# EAGLE design rf_front_lf (EAGLE 9.6.2)
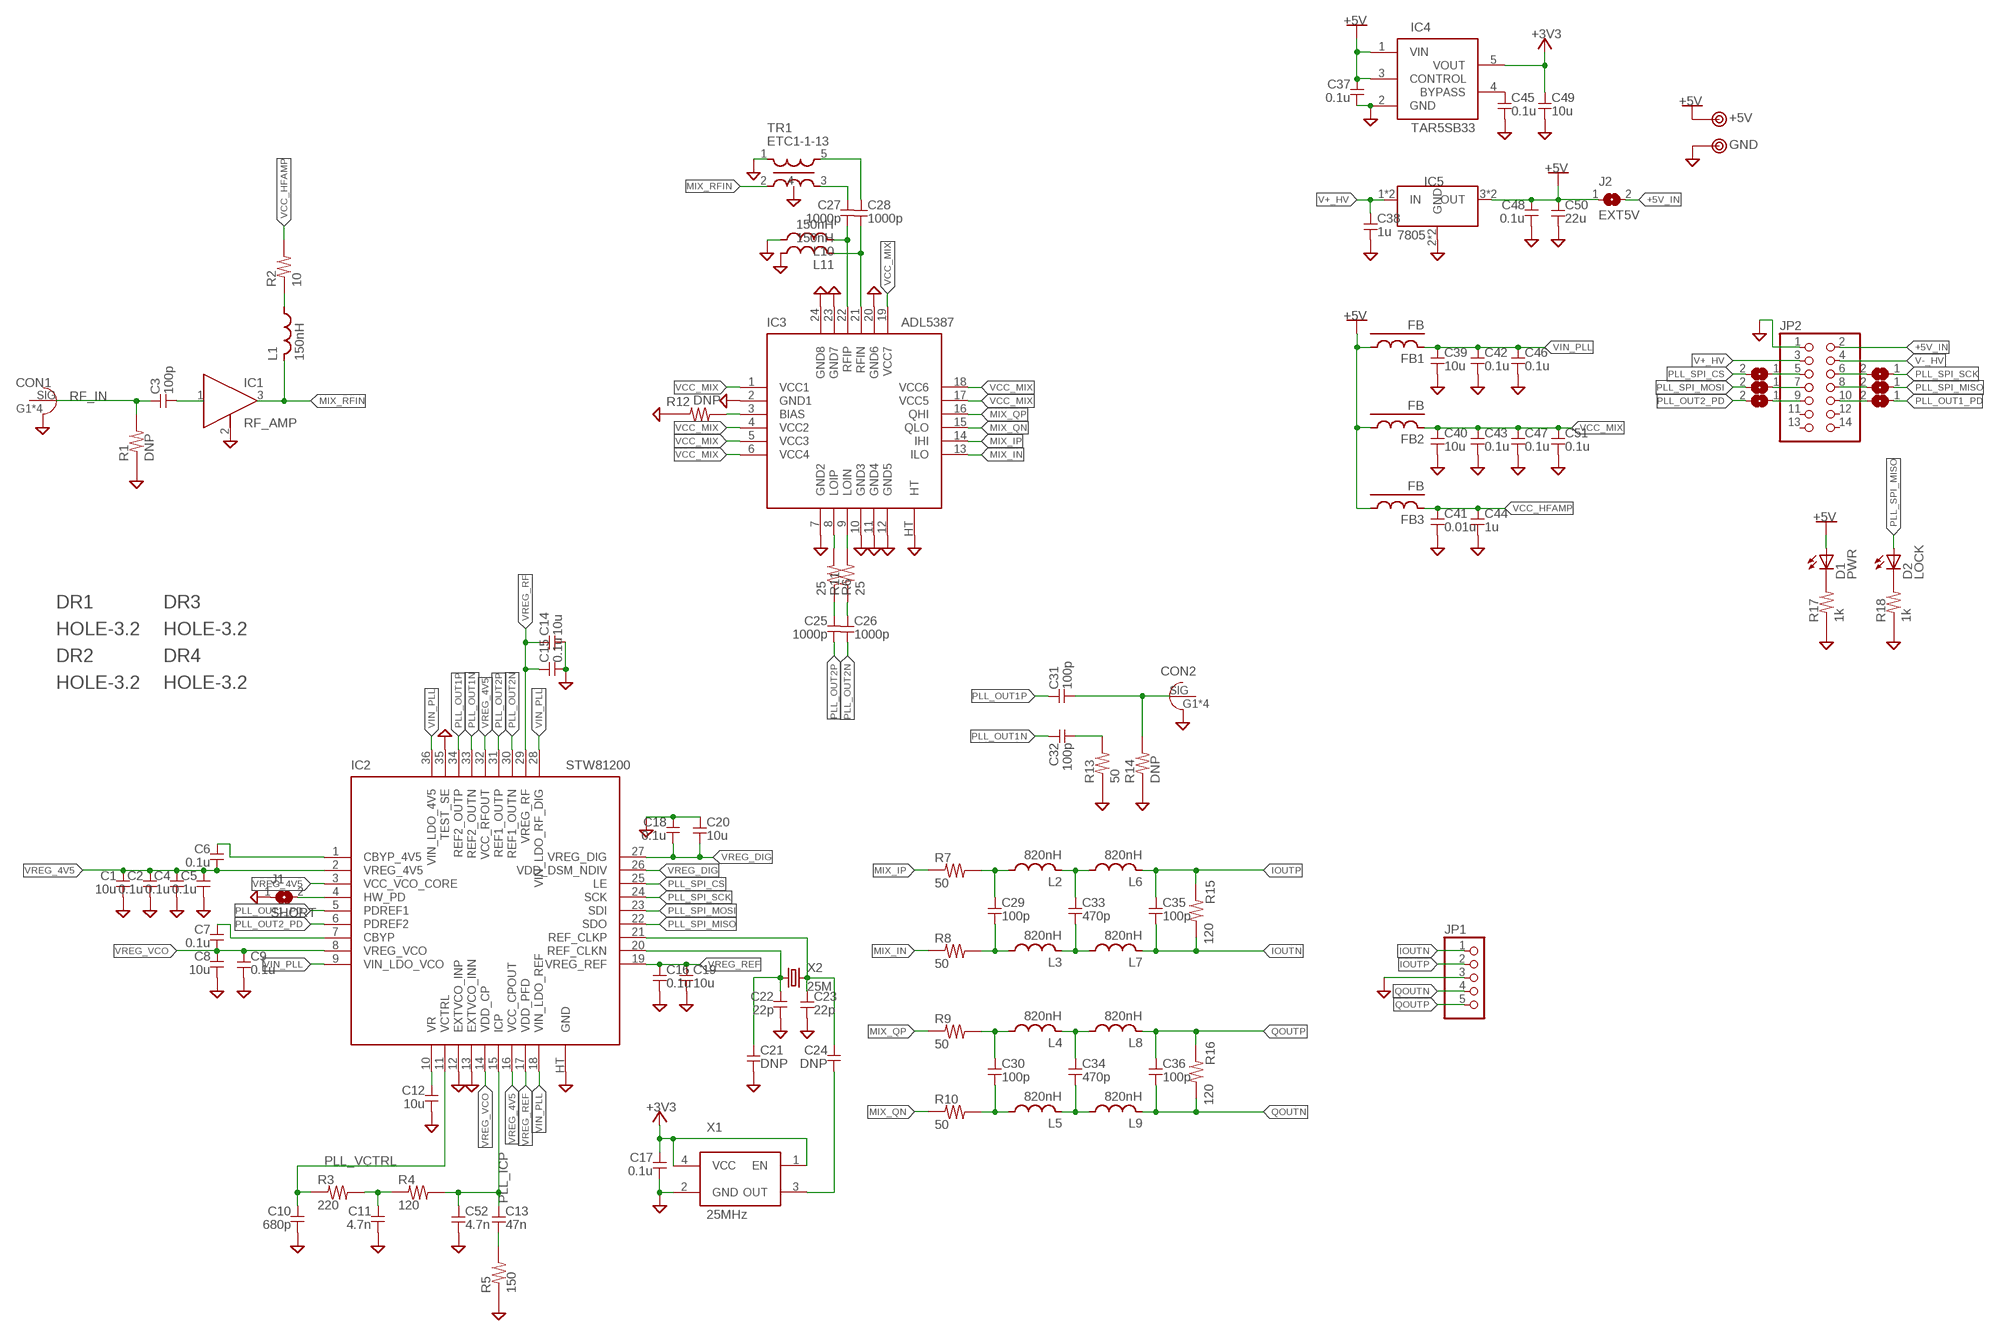
[diagram p0: schematic, sheet 1]

## Parts
C1  10u  C-1608  [1608]
C2  0.1u  C-1608  [1608]
C3  100p  C-1608  [1608]
C4  0.1u  C-1608  [1608]
C5  0.1u  C-1608  [1608]
C6  0.1u  C-1608  [1608]
C7  0.1u  C-1608  [1608]
C8  10u  C-1608  [1608]
C9  0.1u  C-1608  [1608]
C10  680p  C-1608  [1608]
C11  4.7n  C-1608  [1608]
C12  10u  C-1608  [1608]
C13  47n  C-1608  [1608]
C14  10u  C-1608  [1608]
C15  0.1u  C-1608  [1608]
C16  0.1u  C-1608  [1608]
C17  0.1u  C-1608  [1608]
C18  0.1u  C-1608  [1608]
C19  10u  C-1608  [1608]
C20  10u  C-1608  [1608]
C21  DNP  C-1608  [1608]
C22  22p  C-1608  [1608]
C23  22p  C-1608  [1608]
C24  DNP  C-1608  [1608]
C25  1000p  C-1608  [1608]
C26  1000p  C-1608  [1608]
C27  1000p  C-1608  [1608]
C28  1000p  C-1608  [1608]
C29  100p  C-1608  [1608]
C30  100p  C-1608  [1608]
C31  100p  C-1608  [1608]
C32  100p  C-1608  [1608]
C33  470p  C-1608  [1608]
C34  470p  C-1608  [1608]
C35  100p  C-1608  [1608]
C36  100p  C-1608  [1608]
C37  0.1u  C-1608  [1608]
C38  1u  C-1608  [1608]
C39  10u  C-2012  [2012]
C40  10u  C-2012  [2012]
C41  0.01u  C-1608  [1608]
C42  0.1u  C-1608  [1608]
C43  0.1u  C-1608  [1608]
C44  1u  C-1608  [1608]
C45  0.1u  C-1608  [1608]
C46  0.1u  C-1608  [1608]
C47  0.1u  C-1608  [1608]
C48  0.1u  C-1608  [1608]
C49  10u  C-1608  [1608]
C50  22u  C-3225  [3225]
C51  0.1u  C-1608  [1608]
C52  4.7n  C-1608  [1608]
CON1  RF_IN  SMA-142-0701-801  [SMA-EDGE]
CON2  PLL_OUT  SMA-142-0701-801  [SMA-EDGE]
D1  PWR  LED-SMD1608  [D1608]
D2  LOCK  LED-SMD1608  [D1608]
DR1  HOLE-3.2  [HOLE_3.2]
DR2  HOLE-3.2  [HOLE_3.2]
DR3  HOLE-3.2  [HOLE_3.2]
DR4  HOLE-3.2  [HOLE_3.2]
FB1  FB  [1608-J]
FB2  FB  [1608-J]
FB3  FB  [1608-J]
IC1  RF_AMP  [SOT89]
IC2  STW81200  [VFQFPN36]
IC3  ADL5387  [LFCSP24]
IC4  TAR5SB33  [SOT23-5]
IC5  7805  78X-3  [TO220-SOP-DUAL]
J1  SHORT  SJ-1608  [1608-J]
J2  EXT5V  SJ-1608  [1608-J]
J3  CS  SJ-1608  [1608-J]
J4  MOSI  SJ-1608  [1608-J]
J5  PD2  SJ-1608  [1608-J]
J6  SCK  SJ-1608  [1608-J]
J7  MISO  SJ-1608  [1608-J]
J8  PD1  SJ-1608  [1608-J]
JP1  PINHD-1X5  [1X05]
JP2  PINHD-2X7  [2X07]
L1  150nH  L-1608  [1608]
L2  820nH  L-1608  [1608]
L3  820nH  L-1608  [1608]
L4  820nH  L-1608  [1608]
L5  820nH  L-1608  [1608]
L6  820nH  L-1608  [1608]
L7  820nH  L-1608  [1608]
L8  820nH  L-1608  [1608]
L9  820nH  L-1608  [1608]
L10  150nH  L-1608  [1608]
L11  150nH  L-1608  [1608]
R1  DNP  R-1608  [1608]
R2  10  R-1608  [1608]
R3  220  R-1608  [1608]
R4  120  R-1608  [1608]
R5  150  R-1608  [1608]
R6  25  R-1608  [1608]
R7  50  R-1608  [1608]
R8  50  R-1608  [1608]
R9  50  R-1608  [1608]
R10  50  R-1608  [1608]
R11  25  R-1608  [1608]
R12  DNP  R-1608  [1608]
R13  50  R-1608  [1608]
R14  DNP  R-1608  [1608]
R15  120  R-1608  [1608]
R16  120  R-1608  [1608]
R17  1k  R-1608  [1608]
R18  1k  R-1608  [1608]
TP1  +5V  TESTPIN  [TESTPIN]
TP2  GND  TESTPIN  [TESTPIN]
TR1  ETC1-1-13  [ETC1-1-13]
X1  25MHz  OSC-KC3225  [KC3225]
X2  25M  CRYSTALHC49S  [HC49/S]

## Nets
+3V3: C17.1 C49.1 IC4.5(VOUT) X1.1(EN) X1.4(VCC)
+5V: C37.1 C48.1 C50.1 D1.A FB1.1 FB2.1 FB3.1 IC4.1(VIN) IC4.3(CONTROL) IC5.3(OUT) IC5.6(OUT) J2.1 TP1.1
+5V_IN: J2.2 JP2.2
GND: C1.2 C2.2 C4.2 C5.2 C8.2 C9.2 C10.2 C11.2 C12.2 C14.2 C15.2 C16.2 C17.2 C18.1 C19.2 C20.1 C21.2 C22.2 C23.2 C37.2 C38.2 C39.2 C40.2 C41.2 C42.2 C43.2 C44.2 C45.2 C46.2 C47.2 C48.2 C49.2 C50.2 C51.2 C52.2 CON1.G1(GND) CON1.G2(GND) CON1.G3(GND) CON1.G4(GND) CON2.G1(GND) CON2.G2(GND) CON2.G3(GND) CON2.G4(GND) IC1.2(GND) IC2.12(EXTVCO_INP) IC2.13(EXTVCO_INN) IC2.35(TEST_SE) IC2.HT(GND) IC3.2(GND1) IC3.7(GND2) IC3.10(GND3) IC3.11(GND4) IC3.12(GND5) IC3.20(GND6) IC3.23(GND7) IC3.24(GND8) IC3.HT IC4.2(GND) IC5.2(GND) IC5.5(GND) J1.1 JP1.3 JP2.1 L10.1 L11.1 R1.1 R5.1 R12.1 R13.1 R14.1 R17.1 R18.1 TP2.1 TR1.1 TR1.4 X1.2(GND)
IOUTN: C35.2 JP1.1 L7.2 R15.1
IOUTP: C35.1 JP1.2 L6.2 R15.2
MIX_IN: IC3.13(ILO) R8.1
MIX_IP: IC3.14(IHI) R7.1
MIX_QN: IC3.15(QLO) R10.1
MIX_QP: IC3.16(QHI) R9.1
MIX_RFIN: IC1.3(OUT) L1.2 TR1.2
N$1: C3.2 IC1.1(IN)
N$2: C13.2 R5.2
N$3: C33.1 L2.2 L6.1
N$4: C27.2 IC3.22(RFIP) L10.2
N$5: C11.1 R3.2 R4.1
N$6: C33.2 L3.2 L7.1
N$7: C30.1 L4.1 R9.2
N$8: C28.2 IC3.21(RFIN) L11.2
N$9: C30.2 L5.1 R10.2
N$10: C34.1 L4.2 L8.1
N$11: C34.2 L5.2 L9.1
N$12: C12.1 IC2.10(VR)
N$13: C6.1 IC2.1(CBYP_4V5)
N$14: C21.1 C22.1 IC2.20(REF_CLKN) X2.1
N$15: C7.1 IC2.7(CBYP)
N$16: C23.1 C24.1 IC2.21(REF_CLKP) X2.2
N$17: C27.1 TR1.3
N$18: C28.1 TR1.5
N$19: L1.1 R2.1
N$20: IC3.9(LOIN) R11.2
N$21: C24.2 X1.3(OUT)
N$22: C45.1 IC4.4(BYPASS)
N$23: C31.2 CON2.SIG R14.2
N$24: J3.1 JP2.5
N$25: J4.1 JP2.7
N$26: C32.2 R13.2
N$27: J5.1 JP2.9
N$28: J8.2 JP2.10
N$29: J7.2 JP2.8
N$30: J6.2 JP2.6
N$31: IC2.4(HW_PD) J1.2
N$32: C29.1 L2.1 R7.2
N$33: C29.2 L3.1 R8.2
N$34: D1.K R17.2
N$35: IC3.3(BIAS) R12.2
N$36: IC3.8(LOIP) R6.2
N$37: C25.1 R6.1
N$38: C26.1 R11.1
N$39: D2.K R18.2
PLL_ICP: C13.1 C52.1 IC2.15(ICP) R4.2
PLL_OUT1_PD: IC2.5(PDREF1) J8.1
PLL_OUT1N: C32.1 IC2.33(REF2_OUTN)
PLL_OUT1P: C31.1 IC2.34(REF2_OUTP)
PLL_OUT2_PD: IC2.6(PDREF2) J5.2
PLL_OUT2N: C26.2 IC2.30(REF1_OUTN)
PLL_OUT2P: C25.2 IC2.31(REF1_OUTP)
PLL_SPI_CS: IC2.25(LE) J3.2
PLL_SPI_MISO: D2.A IC2.22(SDO) J7.1
PLL_SPI_MOSI: IC2.23(SDI) J4.2
PLL_SPI_SCK: IC2.24(SCK) J6.1
PLL_VCTRL: C10.1 IC2.11(VCTRL) R3.1
QOUTN: C36.2 JP1.4 L9.2 R16.1
QOUTP: C36.1 JP1.5 L8.2 R16.2
RF_IN: C3.1 CON1.SIG R1.2
V+_HV: C38.1 IC5.1(IN) IC5.4(IN) JP2.3
V-_HV: JP2.4
VCC_HFAMP: C41.1 C44.1 FB3.2 R2.2
VCC_MIX: C40.1 C43.1 C47.1 C51.1 FB2.2 IC3.1(VCC1) IC3.4(VCC2) IC3.5(VCC3) IC3.6(VCC4) IC3.17(VCC5) IC3.18(VCC6) IC3.19(VCC7)
VIN_PLL: C39.1 C42.1 C46.1 FB1.2 IC2.9(VIN_LDO_VCO) IC2.18(VIN_LDO_REF) IC2.28(VIN_LDO_RF_DIG) IC2.36(VIN_LDO_4V5)
VREG_4V5: C1.1 C2.1 C4.1 C5.1 C6.2 IC2.2(VREG_4V5) IC2.3(VCC_VCO_CORE) IC2.16(VCC_CPOUT) IC2.32(VCC_RFOUT)
VREG_DIG: C18.2 C20.2 IC2.26(VDD_DSM_NDIV) IC2.27(VREG_DIG)
VREG_REF: C16.1 C19.1 IC2.17(VDD_PFD) IC2.19(VREG_REF)
VREG_RF: C14.1 C15.1 IC2.29(VREG_RF)
VREG_VCO: C7.2 C8.1 C9.1 IC2.8(VREG_VCO) IC2.14(VDD_CP)
Unconnected: JP2.11 JP2.12 JP2.13 JP2.14

## Library data of the parts
C1-C52 = my_rcl:C
CON1 CON2 = my_connector:SMA
D1 D2 = my_rcl:LED
DR1-DR4 = my_connector:HOLE-3.2
FB1-FB3 = my_rcl:FB
IC1 = my_ic:RF_AMP
IC2 = my_ic:STW81200
IC3 = my_ic:ADL5387
IC4 = my_ic:TAR5SB33
IC5 = my_ic:78X
J1-J8 = my_rcl:SJ
JP1 = my_connector:PINHD-1X5: PIN HEADER
JP2 = my_connector:PINHD-2X7: PIN HEADER
L1-L11 = my_rcl:L
R1-R18 = my_rcl:R
TP1 TP2 = my_connector:TESTPIN
TR1 = my_rcl:ETC1-1-13
X1 = my_rcl:OSC
X2 = my_rcl:CRYSTAL: CRYSTAL

## Board
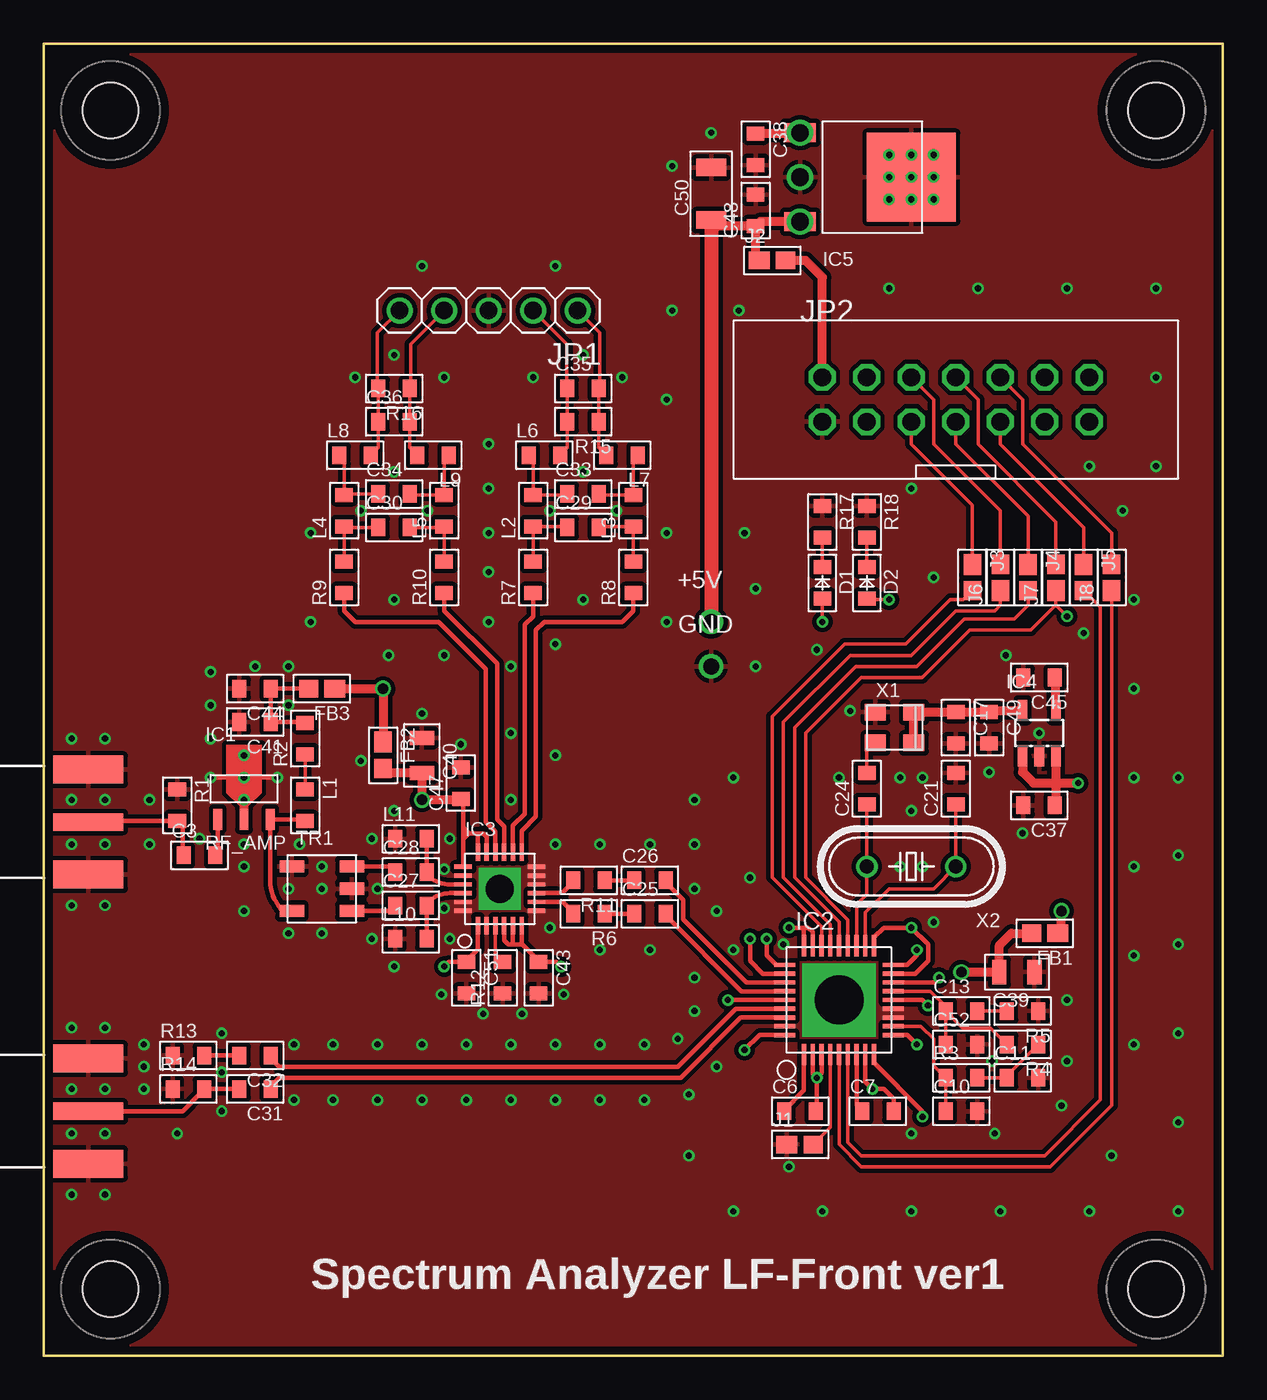
[diagram p1: board, top side]
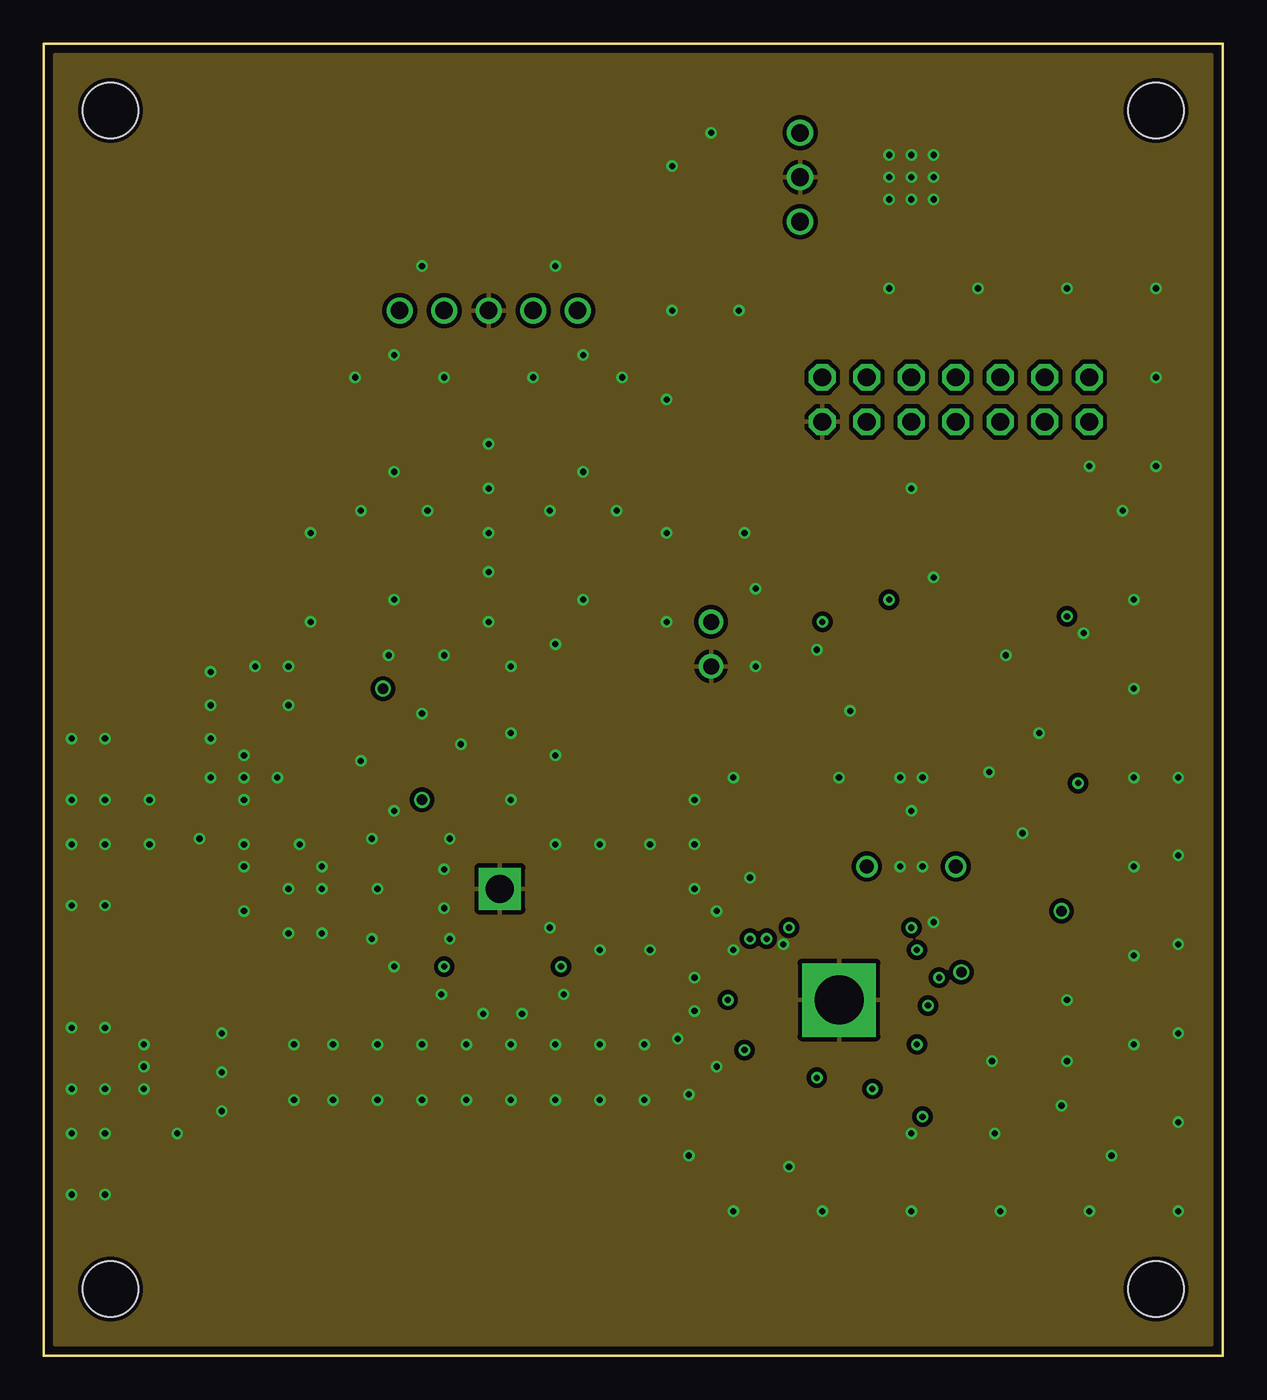
[diagram p2: board, inner layer Route2]
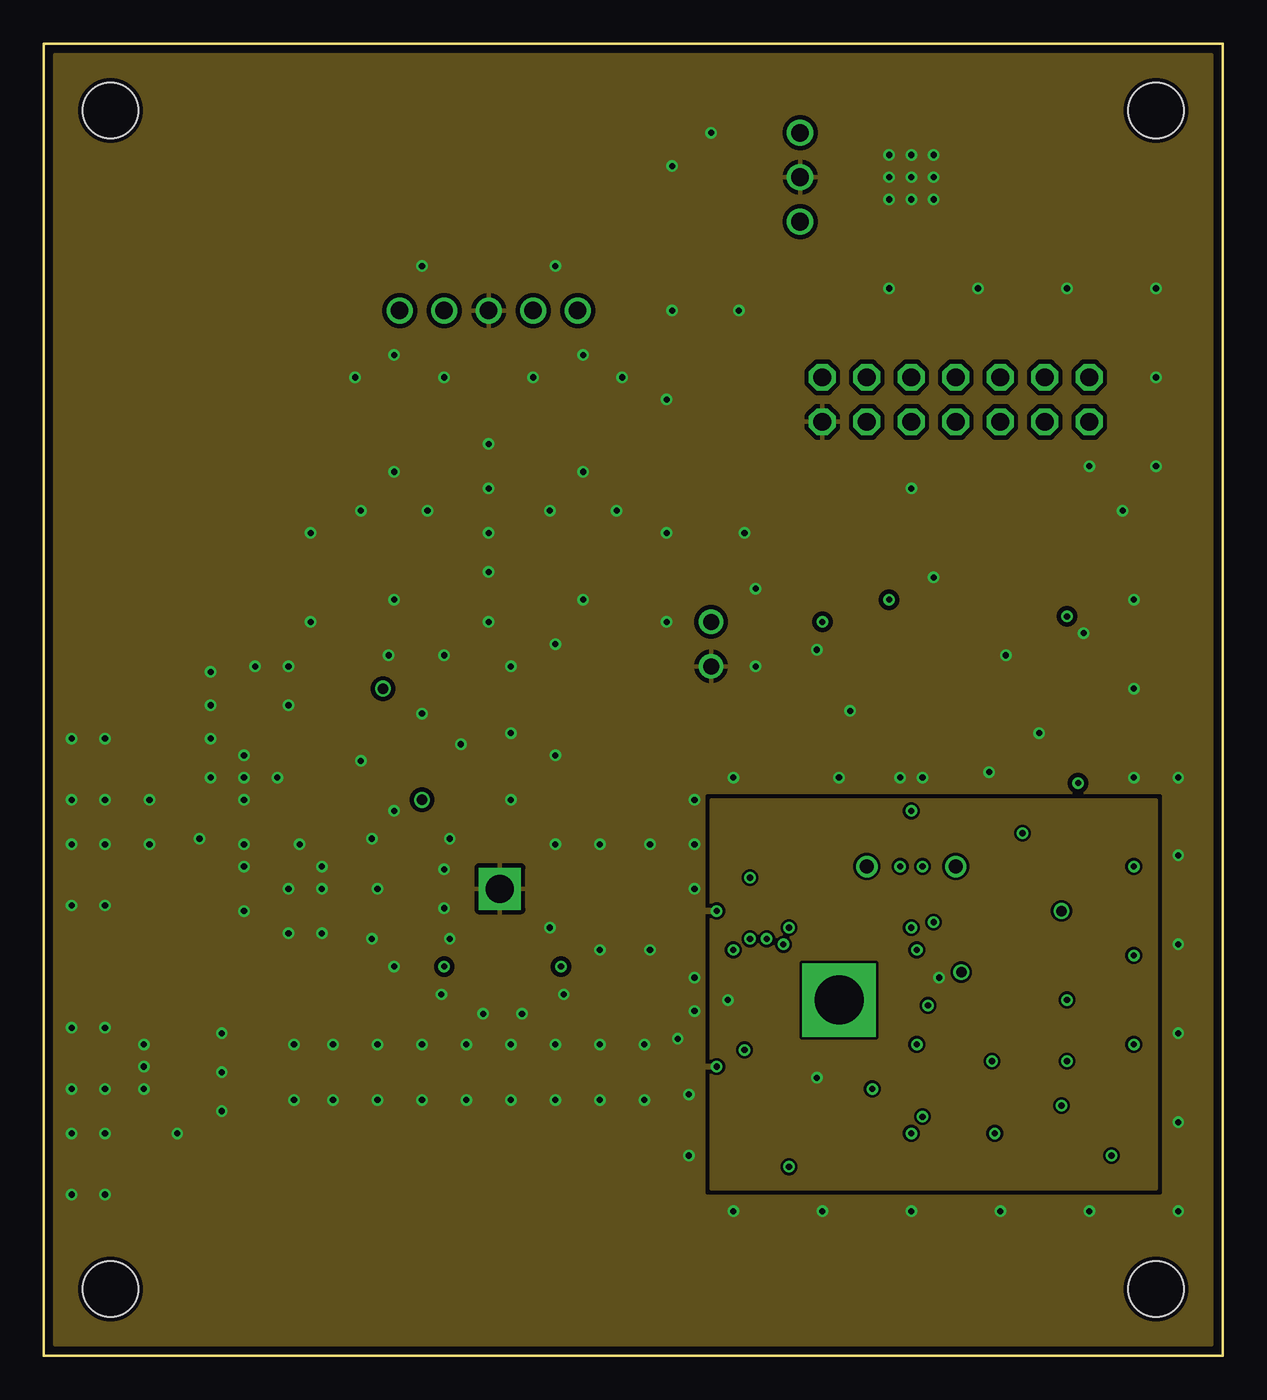
[diagram p3: board, inner layer Route15]
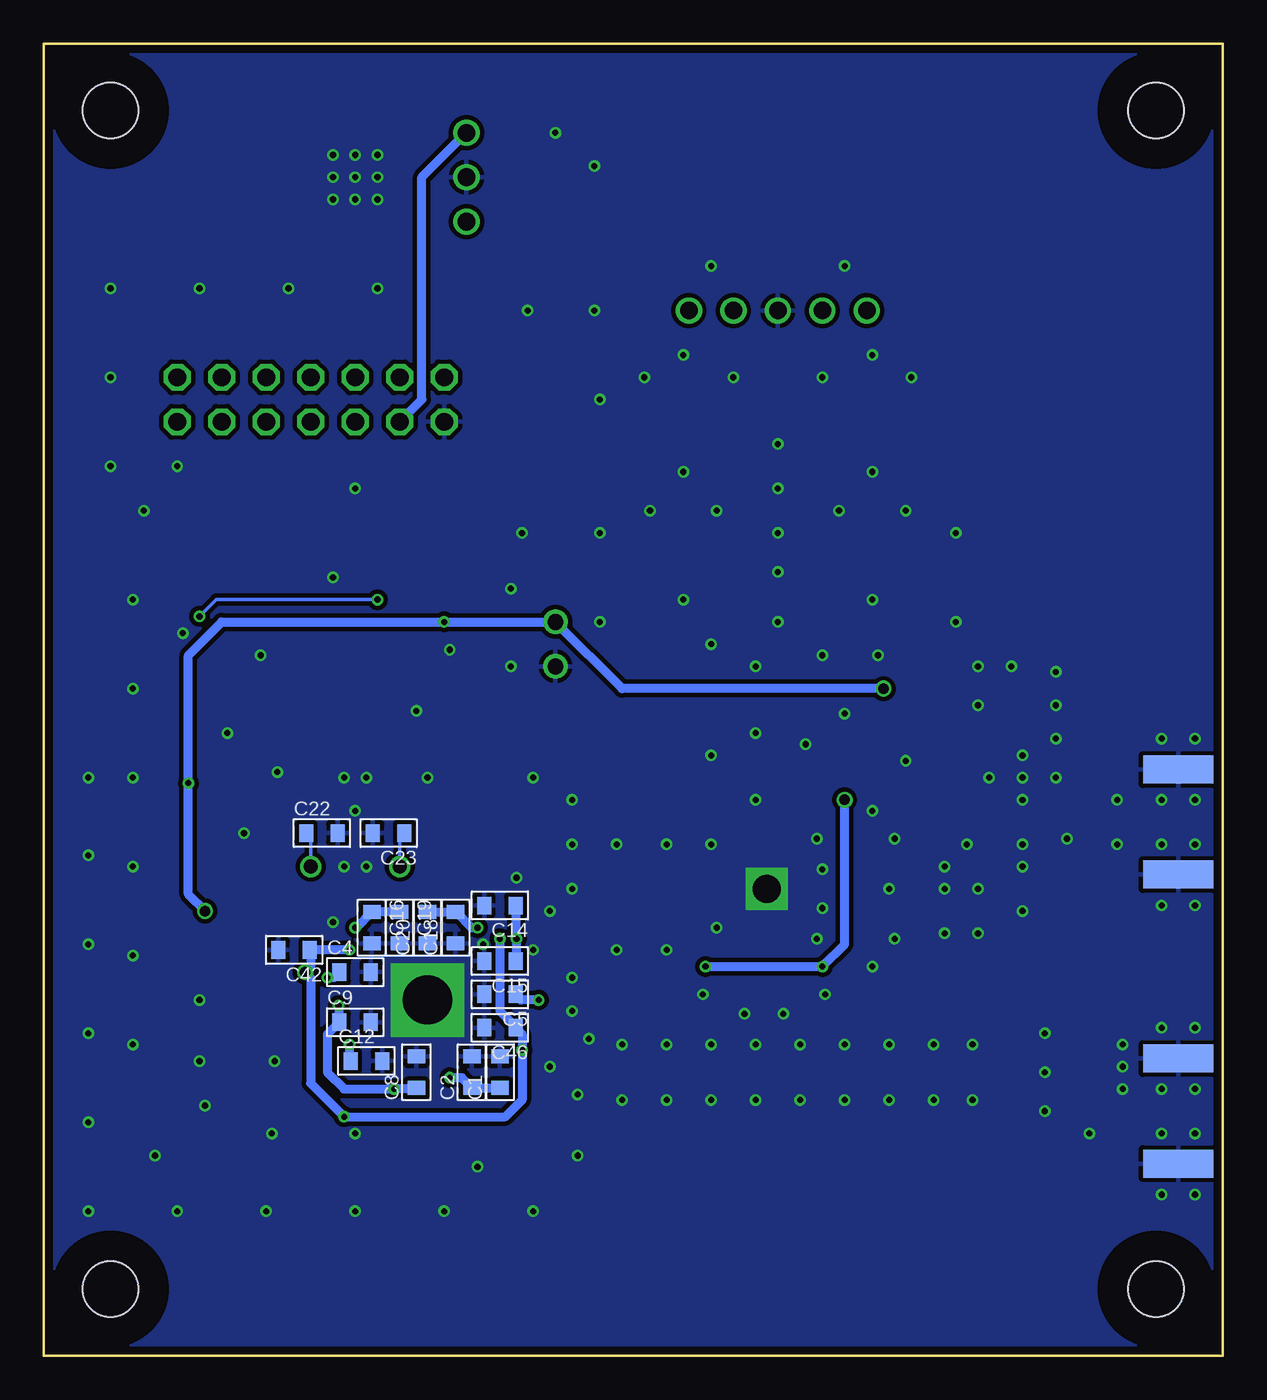
[diagram p4: board, bottom side, seen from below]

Size 67.31 x 74.93 mm. Coordinates in mm from the lower left corner, seen from the top.
Outline: 0,74.93 0,0 67.31,0 67.31,74.93 0,74.93
Copper layers (1*2*15*16): Top 0.035mm / dielectric 0.2mm / Route2 0.0175mm / dielectric 1.065mm / Route15 0.0175mm / dielectric 0.2mm / Bottom 0.035mm
Design rules "JLCPCB_4layer": minimum track width 6mil, minimum drill 0.3mm, track to track 6mil, track to pad 6mil, pad to pad 6mil, via to via 8mil, smd to smd 0mil, copper to edge 0.2mm, drill to drill 0.4mm, minimum pad ring 8mil, minimum via ring 6mil, stop-mask expansion 4mil, vias tented up to drill 1mm, thermal gap 10mil

### Footprints (pad centres in the part's own frame; a part is rotated, then mirrored left to right if it is on the bottom)
1608 = smd 0.8 x 1: 1 -0.9,0; 2 0.9,0
2012 = smd 0.8 x 1.4: 1 -1,0; 2 1,0
3225 = smd 1 x 1.7: 1 -1.5,0; 2 1.5,0
SMA-EDGE = smd 1.6 x 4: G1 -3,0; G2 3,0 | smd 1.6 x 4 bottom: G3 -3,0; G4 3,0 | smd 1 x 4: SIG 0,0
D1608 = smd 0.8 x 1: A 0.9,0; K -0.9,0
HOLE_3.2 = hole 3.2: 0,0
1608-J = smd 1.2 x 1: 1 -0.75,0 | smd 1.1 x 1: 2 0.75,0
SOT89 = smd 0.5 x 1.2: 1 -1.5,-1.75; 2 0,-1.75; 3 1.5,-1.75
VFQFPN36 = smd 0.25 x 1.2: 1 -2,-3.1; 2 -1.5,-3.1; 3 -1,-3.1; 4 -0.5,-3.1; 5 0,-3.1; 6 0.5,-3.1; 7 1,-3.1; 8 1.5,-3.1; 9 2,-3.1; 19 2,3.1; 20 1.5,3.1; 21 1,3.1; 22 0.5,3.1; 23 0,3.1; 24 -0.5,3.1; 25 -1,3.1; 26 -1.5,3.1; 27 -2,3.1 | smd 1.2 x 0.25: 10 3.1,-2; 11 3.1,-1.5; 12 3.1,-1; 13 3.1,-0.5; 14 3.1,0; 15 3.1,0.5; 16 3.1,1; 17 3.1,1.5; 18 3.1,2; 28 -3.1,2; 29 -3.1,1.5; 30 -3.1,1; 31 -3.1,0.5; 32 -3.1,0; 33 -3.1,-0.5; 34 -3.1,-1; 35 -3.1,-1.5; 36 -3.1,-2 | drill 2.8 pad 4 square: HT 0,0
LFCSP24 = smd 0.25 x 1: 1 -1.25,-2.1; 2 -0.75,-2.1; 3 -0.25,-2.1; 4 0.25,-2.1; 5 0.75,-2.1; 6 1.25,-2.1; 13 1.25,2.1; 14 0.75,2.1; 15 0.25,2.1; 16 -0.25,2.1; 17 -0.75,2.1; 18 -1.25,2.1 | smd 1 x 0.25: 7 2.1,-1.25; 8 2.1,-0.75; 9 2.1,-0.25; 10 2.1,0.25; 11 2.1,0.75; 12 2.1,1.25; 19 -2.1,1.25; 20 -2.1,0.75; 21 -2.1,0.25; 22 -2.1,-0.25; 23 -2.1,-0.75; 24 -2.1,-1.25 | drill 1.6 pad 2.4 square: HT 0,0
SOT23-5 = smd 0.55 x 1.2: 1 -0.95,-1.3; 2 0,-1.3; 3 0.95,-1.3; 4 0.95,1.3; 5 -0.95,1.3
TO220-SOP-DUAL = smd 1.1 x 1.8: 1 -2.54,0; 3 2.54,0 | smd 5.08 x 5.08: 2 0,6.35 | drill 1: 4 -2.54,0; 5 0,0; 6 2.54,0
1X05 = drill 1: 1 -5.08,0; 2 -2.54,0; 3 0,0; 4 2.54,0; 5 5.08,0
2X07 = drill 1.016 octagon: 1 -7.62,-1.27; 2 -7.62,1.27; 3 -5.08,-1.27; 4 -5.08,1.27; 5 -2.54,-1.27; 6 -2.54,1.27; 7 0,-1.27; 8 0,1.27; 9 2.54,-1.27; 10 2.54,1.27; 11 5.08,-1.27; 12 5.08,1.27; 13 7.62,-1.27; 14 7.62,1.27
TESTPIN = drill 0.9 pad 1.4: 1 0,0
ETC1-1-13 = smd 1.4 x 0.7: 1 -1.715,1.27; 2 -1.715,-1.27; 3 1.715,-1.27; 4 1.715,0; 5 1.715,1.27
KC3225 = smd 1.2 x 0.95: 1 -1.1,-0.875; 2 1.1,-0.875; 3 1.1,0.875; 4 -1.1,0.875
HC49/S = drill 0.813: 1 -2.54,0; 2 2.54,0

### Placement (x,y rotation side)
C1  41.27,16.19 90 bottom
C2  42.86,16.19 90 bottom
C3  8.89,28.57 0 top
C4  49.53,21.91 0 bottom
C5  41.27,20.64 180 bottom
C6  43.18,13.97 0 top
C7  47.62,13.97 0 top
C8  46.04,16.19 90 bottom
C9  49.53,19.05 0 bottom
C10  52.39,13.97 0 top
C11  55.88,15.88 0 top
C12  48.9,16.83 0 bottom
C13  52.39,19.68 0 top
C14  41.27,25.72 180 bottom
C15  41.27,22.54 180 bottom
C16  48.58,24.45 270 bottom
C17  52.07,35.88 270 top
C18  43.81,24.45 90 bottom
C19  46.99,24.45 270 bottom
C20  45.4,24.45 90 bottom
C21  52.07,32.38 90 top
C22  51.44,29.84 0 bottom
C23  47.62,29.84 180 bottom
C24  46.99,32.38 90 top
C25  34.61,25.24 0 top
C26  34.61,27.15 0 top
C27  20.95,25.72 0 top
C28  20.95,27.62 0 top
C29  30.8,47.31 0 top
C30  20,47.31 0 top
C31  12.06,15.24 180 top
C32  12.06,17.14 180 top
C33  30.8,49.21 0 top
C34  20,49.21 0 top
C35  30.8,55.24 0 top
C36  20,53.34 0 top
C37  56.83,31.43 180 top
C38  40.64,68.9 270 top
C39  55.56,21.91 0 top
C40  21.59,34.29 90 top
C41  12.06,36.2 180 top
C42  53.02,23.18 180 bottom
C43  28.26,21.59 270 top
C44  12.06,38.1 180 top
C45  56.83,38.73 180 top
C46  41.27,18.73 180 bottom
C47  23.81,32.7 90 top
C48  40.64,65.41 90 top
C49  53.98,35.88 270 top
C50  38.1,66.36 90 top
C51  24.13,21.59 270 top
C52  52.39,17.78 0 top
CON1  2.54,30.48 90 top
CON2  2.54,13.97 90 top
D1  44.45,44.13 270 top
D2  46.99,44.13 270 top
DR1  3.81,3.81 0 top
DR2  63.5,3.81 0 top
DR3  3.81,71.12 0 top
DR4  63.5,71.12 0 top
FB1  57.15,24.13 180 top
FB2  19.37,34.29 270 top
FB3  15.88,38.1 180 top
IC1  11.43,32.38 0 top
IC2  45.4,20.32 0 top
IC3  26.04,26.67 0 top
IC4  56.83,35.56 0 top
IC5  43.18,67.31 270 top
J1  43.18,12.06 0 top
J2  41.59,62.55 0 top
J3  53.02,44.45 270 top
J4  56.2,44.45 270 top
J5  59.37,44.45 270 top
J6  54.61,44.45 90 top
J7  57.78,44.45 90 top
J8  60.96,44.45 90 top
JP1  25.4,59.69 180 top
JP2  52.07,54.61 0 top
L1  14.92,31.43 270 top
L2  27.94,48.26 90 top
L3  33.66,48.26 90 top
L4  17.14,48.26 90 top
L5  22.86,48.26 90 top
L6  28.57,51.44 0 top
L7  33.02,51.44 180 top
L8  17.78,51.44 0 top
L9  22.23,51.44 180 top
L10  20.95,23.81 0 top
L11  20.95,29.53 0 top
R1  7.62,31.43 270 top
R2  14.92,35.24 90 top
R3  52.39,15.88 0 top
R4  55.88,17.78 180 top
R5  55.88,19.68 180 top
R6  31.11,25.24 180 top
R7  27.94,44.45 90 top
R8  33.66,44.45 90 top
R9  17.14,44.45 90 top
R10  22.86,44.45 90 top
R11  31.11,27.15 180 top
R12  26.19,21.59 90 top
R13  8.26,17.14 0 top
R14  8.26,15.24 0 top
R15  30.8,53.34 180 top
R16  20,55.24 180 top
R17  44.45,47.62 270 top
R18  46.99,47.62 270 top
TP1  38.1,41.91 0 top
TP2  38.1,39.37 0 top
TR1  15.88,26.67 0 top
X1  48.58,35.88 180 top
X2  49.53,27.94 180 top

### Tracks (layer width: path | path; a pad name or v marks a point on that pad's centre or on a via)
+3V3
  Top 0.508: X1.4 X1.1 49.7,36.78 C17.1 C49.1 54.06,36.86 IC4.5
+5V  (via drill 0.35, 0.6)
  Top 0.203: D1.A v44.45,41.91
  Top 0.508: FB1.1 58.1,24.33 v58.1,25.4 | IC4.1 55.88,33.34 56.52,32.7 57.78,32.7 | 57.78,32.7 v59.05,32.7 | IC4.3 57.78,32.7 | 57.78,32.7 | 57.78,32.7 57.78,31.48 C37.1 | C48.1 40.91,64.77 IC5.6 | C48.1 38.45,64.5 C50.1 | J2.1 40.64,62.75 C48.1 | FB2.1 v19.37,38.1 FB3.1
  Top 0.813: C50.1 TP1.1
  Bottom 0.508: v58.1,25.4 59.05,26.35 v59.05,32.7 59.05,40.01 57.15,41.91 v44.45,41.91 TP1.1 34.29,38.1 v19.37,38.1
+5V_IN
  Top 0.508: J2.2 43.5,62.55 44.45,61.59 JP2.2
GND  (via drill 0.35)
  Top 0.254: v9.53,33.02 v13.34,33.02
  other vias: 50.8,24.77 49.53,12.7 58.42,20.32 58.42,16.83 54.29,12.7 60.96,11.43 42.55,10.79 40.32,27.3 48.9,33.02 50.16,33.02 53.98,33.34 56.83,35.56 55.88,29.84 54.93,40.01 46.04,36.83 42.23,23.5 1.59,31.75 3.49,31.75 1.59,35.24 3.49,35.24 1.59,29.21 3.49,29.21 3.49,25.72 1.59,25.72 1.59,18.73 3.49,18.73 3.49,15.24 1.59,15.24 1.59,12.7 3.49,12.7 1.59,9.21 3.49,9.21 7.62,12.7 10.16,13.97 10.16,16.19 5.71,17.78 5.71,16.51 5.71,15.24 10.16,18.41 14.29,17.78 14.29,14.61 16.51,17.78 19.05,17.78 21.59,17.78 24.13,17.78 26.67,17.78 29.21,17.78 31.75,17.78 34.29,17.78 16.51,14.61 19.05,14.61 21.59,14.61 24.13,14.61 26.67,14.61 29.21,14.61 31.75,14.61 34.29,14.61 36.83,14.92 36.2,18.1 37.15,19.68 38.42,16.51 37.15,21.59 38.42,25.4 39.37,23.18 15.88,27.94 14.61,29.21 11.43,29.21 11.43,27.94 6.03,29.21 6.03,31.75 8.89,29.53 11.43,34.29 11.43,33.02 11.43,31.75 9.53,35.24 9.53,37.15 9.53,39.05 12.06,39.37 13.97,39.37 13.97,37.15 40.64,39.37 20,43.18 25.4,41.91 20,50.48 15.24,41.91 30.8,50.48 30.8,43.18 32.7,48.26 28.89,48.26 21.91,48.26 18.1,48.26 20,57.15 30.8,57.15 22.86,55.88 27.94,55.88 17.78,55.88 33.02,55.88 25.4,49.53 25.4,52.07 25.4,46.99 25.4,44.77 35.56,46.99 15.24,46.99 44.13,40.32 59.69,50.8 61.59,48.26 62.23,43.18 62.23,38.1 62.23,33.02 62.23,27.94 62.23,22.86 62.23,17.78 58.1,14.29 45.4,33.02 49.53,31.11 50.16,27.94 48.9,27.94 39.37,33.02 36.83,11.43 39.37,8.26 44.45,8.26 49.53,8.26 54.61,8.26 59.69,8.26 64.77,8.26 64.77,13.34 64.77,18.41 64.77,23.5 64.77,28.57 64.77,33.02 35.56,41.91 40.64,43.81 50.8,44.45 40.01,46.99 39.69,59.69 35.88,59.69 35.56,54.61 38.1,69.85 35.88,67.94 48.26,68.58 50.8,68.58 49.53,68.58 49.53,67.31 48.26,67.31 48.26,66.04 49.53,66.04 50.8,66.04 50.8,67.31 48.26,60.96 53.34,60.96 58.42,60.96 63.5,60.96 63.5,55.88 63.5,50.8 29.21,62.23 21.59,62.23 49.53,49.53 22.86,25.56 22.86,27.78 23.18,23.81 23.18,29.53 18.73,23.81 18.73,29.53 20,31.11 20,22.23 22.7,20.64 25.08,19.53 27.3,19.53 29.69,20.64 28.89,24.45 29.21,29.21 23.81,34.92 21.59,36.67 18.1,33.97 26.67,31.75 26.67,35.56 26.67,39.37 29.21,34.29 22.86,40.01 29.21,40.64 19.68,40.01 34.61,29.21 34.61,23.18 31.75,29.21 31.75,23.18 19.05,26.67 15.88,26.67 13.97,26.67 15.88,24.13 13.97,24.13 11.43,25.4 37.15,26.67 37.15,29.21 37.15,31.75 59.37,41.27 54.13,16.83
  pour Bottom (isolate 0.254): 0.64,74.3 66.67,74.3 66.67,0.64 0.64,0.64
  pour Top (isolate 0.254): 0.64,74.3 66.67,74.3 66.67,0.64 0.64,0.64
  pour Top (isolate 0.254, no thermals): 49.85,24.45 40.64,24.45 40.64,15.88 49.85,15.88
  pour Bottom (isolate 0.254, no thermals): 43.02,22.7 43.02,17.94 47.78,17.94 47.78,22.7
  pour Top (isolate 0.254, no thermals): 28.89,29.53 23.18,29.53 23.18,23.81 28.89,23.81
  pour Bottom (isolate 0.254, no thermals): 24.45,28.26 24.45,25.08 27.62,25.08 27.62,28.26
  pour Route2 (isolate 0.254): 0.64,74.3 0.64,0.64 66.67,0.64 66.67,74.3
  pour Route15 (isolate 0.254, rank 2): 0.64,74.3 66.67,74.3 66.67,0.64 0.64,0.64
IOUTN
  Top 0.203: L7.2 31.7,51.86 R15.1 C35.2 31.75,55.3 31.75,58.42 JP1.1
IOUTP
  Top 0.203: L6.2 29.9,51.86 R15.2 C35.1 29.84,55.3 29.84,57.78 JP1.2
MIX_IN
  Top 0.254: R8.1 33.66,42.55 33.02,41.91 28.57,41.91 28.1,41.43 28.1,30.8 27.29,29.98 IC3.13
MIX_IP
  Top 0.254: R7.1 27.94,42.23 27.46,41.75 27.46,30.96 26.79,30.28 IC3.14
MIX_QN
  Top 0.254: R10.1 22.86,42.55 25.88,39.53 25.88,30.64 26.29,30.23 IC3.15
MIX_QP
  Top 0.254: R9.1 17.14,42.55 17.78,41.91 22.54,41.91 25.24,39.21 25.24,30.48 25.79,29.94 IC3.16
MIX_RFIN
  Top 0.254: L1.2 14.82,30.64 IC1.3 12.93,27.14 arc45 13.65,25.4 TR1.2
N$1
  Top 0.254: C3.2 9.93,28.71 IC1.1
N$2
  Top 0.203: C13.2 R5.2
N$3
  Top 0.203: C33.1 29.84,49.16 L2.2 27.94,51.17 L6.1
N$4
  Top 0.254: IC3.22 23.19,26.42 arc45 21.93,25.9 arc45 C27.2 L10.2
N$5
  Top 0.203: C11.1 54.93,15.88 | 54.93,15.88 R3.2 | R4.1 54.93,15.93 54.93,15.88
N$6
  Top 0.203: C33.2 31.75,49.16 L3.2 33.66,51.17 L7.1
N$7
  Top 0.203: R9.2 L4.1 17.2,47.31 C30.1
N$8
  Top 0.254: IC3.21 23.19,26.92 arc-45 21.93,27.44 arc-45 C28.2 L11.2
N$9
  Top 0.203: R10.2 L5.1 22.81,47.31 C30.2
N$10
  Top 0.203: C34.1 17.2,49.21 L4.2 17.14,51.17 L8.1
N$11
  Top 0.203: C34.2 20.95,49.16 L5.2 22.86,51.17 L9.1
N$12  (via drill 0.35)
  Top 0.254: IC2.10 49.31,18.32 v49.85,17.78
  Bottom 0.508: C12.1 49.85,16.88 v49.85,17.78
N$13
  Top 0.254: IC2.1 43.4,15.14 42.28,14.02 C6.1
N$14
  Top 0.203: IC2.20 46.9,25.31 48.26,26.67 50.8,26.67 X2.1 C21.1
  Bottom 0.203: X2.1 52.07,29.58 C22.1
N$15
  Top 0.254: IC2.7 46.4,14.29 C7.1
N$16
  Top 0.203: IC2.21 46.4,25.77 46.99,26.35 X2.2 C24.1
  Bottom 0.203: X2.2 46.99,29.58 C23.1
N$17
  Top 0.254: TR1.3 19.74,25.4 C27.1
N$18
  Top 0.254: TR1.5 19.74,27.94 C28.1
N$19
  Top 0.203: L1.1 R2.1
N$20
  Top 0.254: IC3.9 29.59,26.42 30.21,27.04 R11.2
N$21
  Top 0.203: C24.2 46.99,34.52 X1.3
N$22
  Top 0.508: IC4.4 57.78,38.69 C45.1
N$23
  Top 0.203: R14.2 9.15,15.19 8.89,14.92
  Top 0.254: CON2.SIG 7.94,13.97 8.89,14.92 | R14.2 C31.2
N$24
  Top 0.203: J3.1 53.02,48.58 49.53,52.07 JP2.5
N$25
  Top 0.203: J4.1 56.2,47.94 52.07,52.07 JP2.7
N$26
  Top 0.254: C32.2 R13.2
N$27
  Top 0.203: J5.1 59.37,47.31 54.61,52.07 JP2.9
N$28
  Top 0.203: J8.2 60.96,46.99 55.88,52.07 55.88,54.61 JP2.10
N$29
  Top 0.203: J7.2 57.78,47.62 53.34,52.07 53.34,54.61 JP2.8
N$30
  Top 0.203: J6.2 54.61,48.26 50.8,52.07 50.8,54.61 JP2.6
N$31
  Top 0.203: J1.2 44.9,13.04 IC2.4
N$32
  Top 0.203: R7.2 L2.1 29.84,47.36 C29.1
N$33
  Top 0.203: R8.2 L3.1 31.75,47.36 C29.2
N$34
  Top 0.203: D1.K R17.2
N$35
  Top 0.203: IC3.3 25.79,22.79 26.09,22.49 R12.2
N$36
  Top 0.254: IC3.8 29.64,25.92 30.21,25.35 R6.2
N$37
  Top 0.254: R6.1 C25.1
N$38
  Top 0.254: C26.1 R11.1
N$39
  Top 0.203: R18.2 D2.K
PLL_ICP
  Top 0.203: IC2.15 50.62,20.82 51.49,19.95 C13.1 | C13.1 C52.1 | R4.2 54.03,18.73 52.44,18.73 C13.1
PLL_OUT1_PD
  Top 0.203: IC2.5 45.4,12.06 46.67,10.79 57.47,10.79 60.96,14.29 J8.1
PLL_OUT1N
  Top 0.254: IC2.33 39.51,19.82 36.2,16.51 13.44,16.51 12.96,16.99 C32.1
PLL_OUT1P
  Top 0.254: IC2.34 39.8,19.32 36.35,15.88 13.44,15.88 12.96,15.4 C31.1
PLL_OUT2_PD
  Top 0.203: IC2.6 45.9,12.2 46.67,11.43 57.15,11.43 60.33,14.61 60.33,42.75 J5.2
PLL_OUT2N
  Top 0.254: IC2.30 40.12,21.32 36.51,24.92 36.51,26.04 35.51,27.04 C26.2
PLL_OUT2P
  Top 0.254: IC2.31 39.85,20.82 39.82,20.82 35.51,25.14 C25.2
PLL_SPI_CS
  Top 0.203: IC2.25 44.4,24.5 41.59,27.3 41.59,36.51 45.72,40.64 49.21,40.64 51.75,43.18 52.5,43.18 J3.2
PLL_SPI_MISO  (via drill 0.35)
  Top 0.203: IC2.22 45.9,24.9 43.5,27.3 43.5,35.56 46.67,38.73 50.16,38.73 52.86,41.43 56.36,41.43 57.78,42.86 | J7.1 57.78,42.86 | D2.A 46.94,43.23 46.99,43.18 v48.26,43.18 | v58.42,42.23 57.78,42.86
  Bottom 0.203: v48.26,43.18 57.47,43.18 v58.42,42.23
PLL_SPI_MOSI
  Top 0.203: IC2.23 45.4,24.77 42.86,27.3 42.86,35.88 46.35,39.37 49.85,39.37 52.55,42.07 55.4,42.07 56.2,42.86 J4.2
PLL_SPI_SCK
  Top 0.203: IC2.24 44.9,24.63 42.23,27.3 42.23,36.2 46.04,40.01 49.53,40.01 52.07,42.55 54.29,42.55 54.61,42.86 J6.1
PLL_VCTRL
  Top 0.203: IC2.11 50.08,18.82 50.8,18.1 50.8,17.14 50.8,16.83 50.8,16.56 R3.1 C10.1
QOUTN
  Top 0.203: L9.2 20.9,51.86 C36.2 R16.1 20.95,55.3 20.95,57.78 JP1.4
QOUTP
  Top 0.203: L8.2 19.1,51.86 C36.1 R16.2 19.05,55.3 19.05,58.42 JP1.5
RF_IN
  Top 0.203: 7.94,28.63 C3.1
  Top 0.254: CON1.SIG 2.59,30.53 R1.2 7.94,30.21 7.94,28.63
V+_HV
  Top 0.508: IC5.4 43.13,69.8 C38.1
  Bottom 0.508: JP2.3 45.72,54.61 45.72,67.31 IC5.4
VCC_HFAMP
  Top 0.254: R2.2 14.87,36.2 C41.1 C44.1 FB3.2
VCC_MIX  (via drill 0.35, 0.6)
  Top 0.254: IC3.1 24.79,23.2 24.13,22.54 C51.1 23.12,22.49 v22.86,22.23 | 26.83,23.5 27.29,23.5 27.29,23.52 | IC3.18 24.79,29.82 | C47.1 23.97,31.64 23.93,31.61 23.93,30.16 | IC3.17 25.29,29.64 25.1,29.82 24.79,29.82 | IC3.19 23.93,29.53 | 23.93,29.53 23.93,29.82 | 23.93,30.16 23.93,29.82 | 24.79,29.82 24.27,29.82 | 24.27,29.82 23.93,29.82 | v29.53,22.23 29.26,22.49 C43.1 28.26,22.54 27.29,23.52 | IC3.6 27.29,23.52 | IC3.5 26.79,23.54 26.83,23.5 | IC3.4 26.29,23.72 26.51,23.5 26.83,23.5 | 24.27,29.82 24.19,29.91 | 24.19,29.91 23.93,30.16 | 24.19,29.91 24.19,29.78 23.93,29.53
  Top 0.508: C47.1 23.76,31.75 v21.59,31.75 C40.1 19.62,33.29 FB2.2
  Bottom 0.508: v29.53,22.23 v22.86,22.23 21.59,23.5 v21.59,31.75
VIN_PLL  (via drill 0.35, 0.6)
  Top 0.254: IC2.18 49.31,22.32 49.85,22.86 v49.85,23.18 | IC2.36 40.86,18.32 v40.01,17.46 | IC2.9 47.4,16.73 50.16,13.97 v50.16,13.65 | IC2.28 41.81,22.32 41.27,22.86 v41.27,23.81
  Top 0.508: v52.39,21.91 C39.1 54.56,23.45 55.24,24.13 FB1.2
  Bottom 0.508: v49.85,23.18 C42.1 52.07,23.12 52.07,22.23 v52.39,21.91 52.07,21.59 52.07,15.56 v50.16,13.65 40.96,13.65 40.01,14.61 v40.01,17.46 40.01,18.36 C46.1 40.38,18.79 41.27,19.68 v41.27,23.81
VREG_4V5  (via drill 0.35)
  Top 0.254: IC2.32 v39.05,20.32 | IC2.3 44.4,16.14 v44.13,15.88 | IC2.2 43.9,16.11 v44.13,15.88 | IC2.16 50.85,21.32 v51.12,21.59 | C6.2 44.13,14.02 v44.13,15.88
  Bottom 0.508: v44.13,15.88 43.45,15.88 C2.1 C1.1 | C4.1 50.75,21.59 v51.12,21.59 | v39.05,20.32 40.06,20.32 C5.1
  pour Route15: 38.1,31.75 38.1,9.53 63.5,9.53 63.5,31.75
VREG_DIG  (via drill 0.35)
  Top 0.254: IC2.26 43.9,24.2 43.66,24.45 43.4,24.45 | 43.4,24.45 v42.55,24.45 | IC2.27 43.4,24.45
  Bottom 0.508: C20.2 C18.2 43.76,25.35 42.86,24.45 v42.55,24.45
VREG_REF  (via drill 0.35)
  Top 0.254: IC2.17 49.76,21.82 50.48,22.54 50.48,23.5 v49.53,24.45 47.94,24.45 47.4,23.91 IC2.19
  Bottom 0.508: C19.1 C16.1 49.48,24.45 v49.53,24.45
VREG_RF  (via drill 0.35)
  Top 0.254: IC2.29 41.05,21.82 40.32,22.54 v40.32,23.81
  Bottom 0.508: C14.1 40.32,25.66 v40.32,23.81 40.32,22.59 C15.1
VREG_VCO  (via drill 0.35)
  Top 0.254: IC2.14 50.16,20.32 v50.48,20 | IC2.8 46.9,15.64 v47.31,15.24 47.94,15.24 48.52,14.66 C7.2
  Bottom 0.508: C8.1 45.98,15.29 46.04,15.24 v47.31,15.24 50.16,15.24 51.12,16.19 51.12,18.36 C9.1 50.48,19.1 v50.48,20

### Text on the board
tPlace: Spectrum Analyzer LF-Front ver1